# EAGLE design KissCart64-8K-MCU (EAGLE 6.6.0)
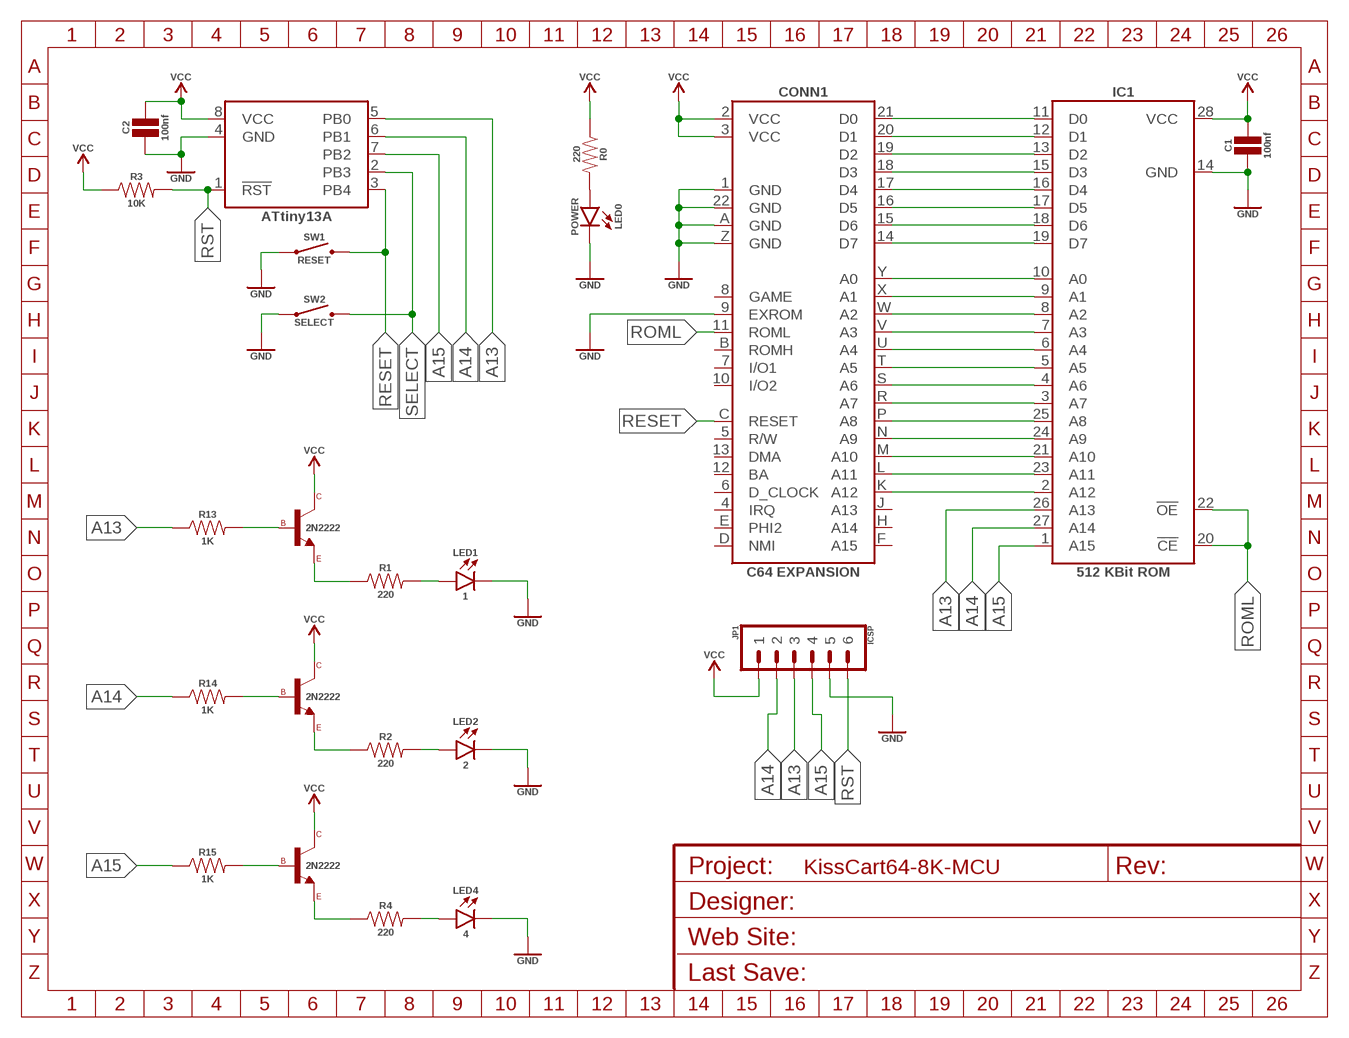
[diagram p0: schematic, sheet 1]
FRAME1 (FRAME_A5L): DESIGNER: Simon/CGTr; REVISION: 1.0; WEBSITE: http://www.commodore.gen.tr

## Parts
C1  100nf  CAPACITOR_CERAMIC_0.2  [CAPACITOR_CERAMIC_0.2]
C2  100nf  CAPACITOR_CERAMIC_1206  [CAPACITOR_CERAMIC_1206]
CONN1  C64 EXPANSION  C64_CARTDRIGE  [C64_CARTRIDGE]
IC1  512 KBit ROM  27C512_DIP  [DIP28W]
IC2  ATtiny13A  ATTINY13A-SU  [SOP08]
JP1  ICSP  HDR_2X03  [HDR_2X03]
LED0  POWER  LED_NORMAL_1206  [LED_1206]
LED1  1  LED_NORMAL_1206  [LED_1206]
LED2  2  LED_NORMAL_1206  [LED_1206]
LED4  4  LED_NORMAL_1206  [LED_1206]
Q1  2N2222  TRANSISTOR_NPN_MMBT2222A  [SOT-23]
Q2  2N2222  TRANSISTOR_NPN_MMBT2222A  [SOT-23]
Q3  2N2222  TRANSISTOR_NPN_MMBT2222A  [SOT-23]
R0  220  RESISTOR_SMT_1206  [RESISTOR_SMT_1206]
R1  220  RESISTOR_SMT_1206  [RESISTOR_SMT_1206]
R2  220  RESISTOR_SMT_1206  [RESISTOR_SMT_1206]
R3  10K  RESISTOR_SMT_1206  [RESISTOR_SMT_1206]
R4  220  RESISTOR_SMT_1206  [RESISTOR_SMT_1206]
R13  1K  RESISTOR_SMT_1206  [RESISTOR_SMT_1206]
R14  1K  RESISTOR_SMT_1206  [RESISTOR_SMT_1206]
R15  1K  RESISTOR_SMT_1206  [RESISTOR_SMT_1206]
SW1  RESET  SWITCH_THT_SIDE  [SWITCH_THT_SIDE]
SW2  SELECT  SWITCH_THT_SIDE  [SWITCH_THT_SIDE]

## Nets
A0: CONN1.Y(A0) IC1.10(A0)
A1: CONN1.X(A1) IC1.9(A1)
A2: CONN1.W(A2) IC1.8(A2)
A3: CONN1.V(A3) IC1.7(A3)
A4: CONN1.U(A4) IC1.6(A4)
A5: CONN1.T(A5) IC1.5(A5)
A6: CONN1.S(A6) IC1.4(A6)
A7: CONN1.R(A7) IC1.3(A7)
A8: CONN1.P(A8) IC1.25(A8)
A9: CONN1.N(A9) IC1.24(A9)
A10: CONN1.M(A10) IC1.21(A10)
A11: CONN1.L(A11) IC1.23(A11)
A12: CONN1.K(A12) IC1.2(A12)
A13: IC1.26(A13) IC2.5(PB0) JP1.3 R13.1
A13_1: Q1.1(BASE) R13.2
A14: IC1.27(A14) IC2.6(PB1) JP1.2 R14.1
A14_1: Q2.1(BASE) R14.2
A15: IC1.1(A15) IC2.7(PB2) JP1.4 R15.1
A15_1: Q3.1(BASE) R15.2
D0: CONN1.21(D0) IC1.11(D0)
D1: CONN1.20(D1) IC1.12(D1)
D2: CONN1.19(D2) IC1.13(D2)
D3: CONN1.18(D3) IC1.15(D3)
D4: CONN1.17(D4) IC1.16(D4)
D5: CONN1.16(D5) IC1.17(D5)
D6: CONN1.15(D6) IC1.18(D6)
D7: CONN1.14(D7) IC1.19(D7)
GND: C1.1 C2.1 CONN1.1(GND) CONN1.9(EXROM) CONN1.22(GND) CONN1.A(GND) CONN1.Z(GND) IC1.14(GND) IC2.4(GND) JP1.5 LED0.C LED1.C LED2.C LED4.C SW1.1 SW2.1
LED0_1: LED0.A R0.2
LED1_1: Q1.2(EMITTER) R1.1
LED1_2: LED1.A R1.2
LED2_1: Q2.2(EMITTER) R2.1
LED2_2: LED2.A R2.2
LED4_1: Q3.2(EMITTER) R4.1
LED4_2: LED4.A R4.2
RESET: CONN1.C(RESET) IC2.3(PB4) SW1.2
ROML: CONN1.11(ROML) IC1.20(!CE) IC1.22(!OE)
RST: IC2.1(!RST) JP1.6 R3.2
SELECT: IC2.2(PB3) SW2.2
VCC: C1.2 C2.2 CONN1.2(VCC) CONN1.3(VCC) IC1.28(VCC) IC2.8(VCC) JP1.1 Q1.3(COLLECTOR) Q2.3(COLLECTOR) Q3.3(COLLECTOR) R0.1 R3.1
Unconnected: CONN1.4(IRQ) CONN1.5(R/W) CONN1.6(D_CLOCK) CONN1.7(I/O1) CONN1.8(GAME) CONN1.10(I/O2) CONN1.12(BA) CONN1.13(DMA) CONN1.B(ROMH) CONN1.D(NMI) CONN1.E(PHI2) CONN1.F(A15) CONN1.H(A14) CONN1.J(A13)

## Library data of the parts
C1 C2 = sj_standart:CAPACITOR_CERAMIC: Ceramic Capacitor
CONN1 = sj_commodore:C64_CARTDRIGE: C64 Cartridge Pads
IC1 = sj_ic:27C512: CMOS EPROM 512 K (64 K x 8)
IC2 = sj_mcu:ATTINY13: ATTINY13 MCU - 1 KB FLASH, 64 bytes SRAM, 64 bytes EEPROM
JP1 = sj_connectors:HDR_2X03: 2x03 - 0.1" Pin Header
LED0 LED1 LED2 LED4 = sj_standart:LED_NORMAL: Standard LED
Q1-Q3 = sj_standart:TRANSISTOR_NPN: Generic NPN Bipolar Junction Transistor
R0 R1-R4 R13-R15 = sj_standart:RESISTOR: Resistor
SW1 SW2 = sj_standart:SWITCH: Switch

## Board
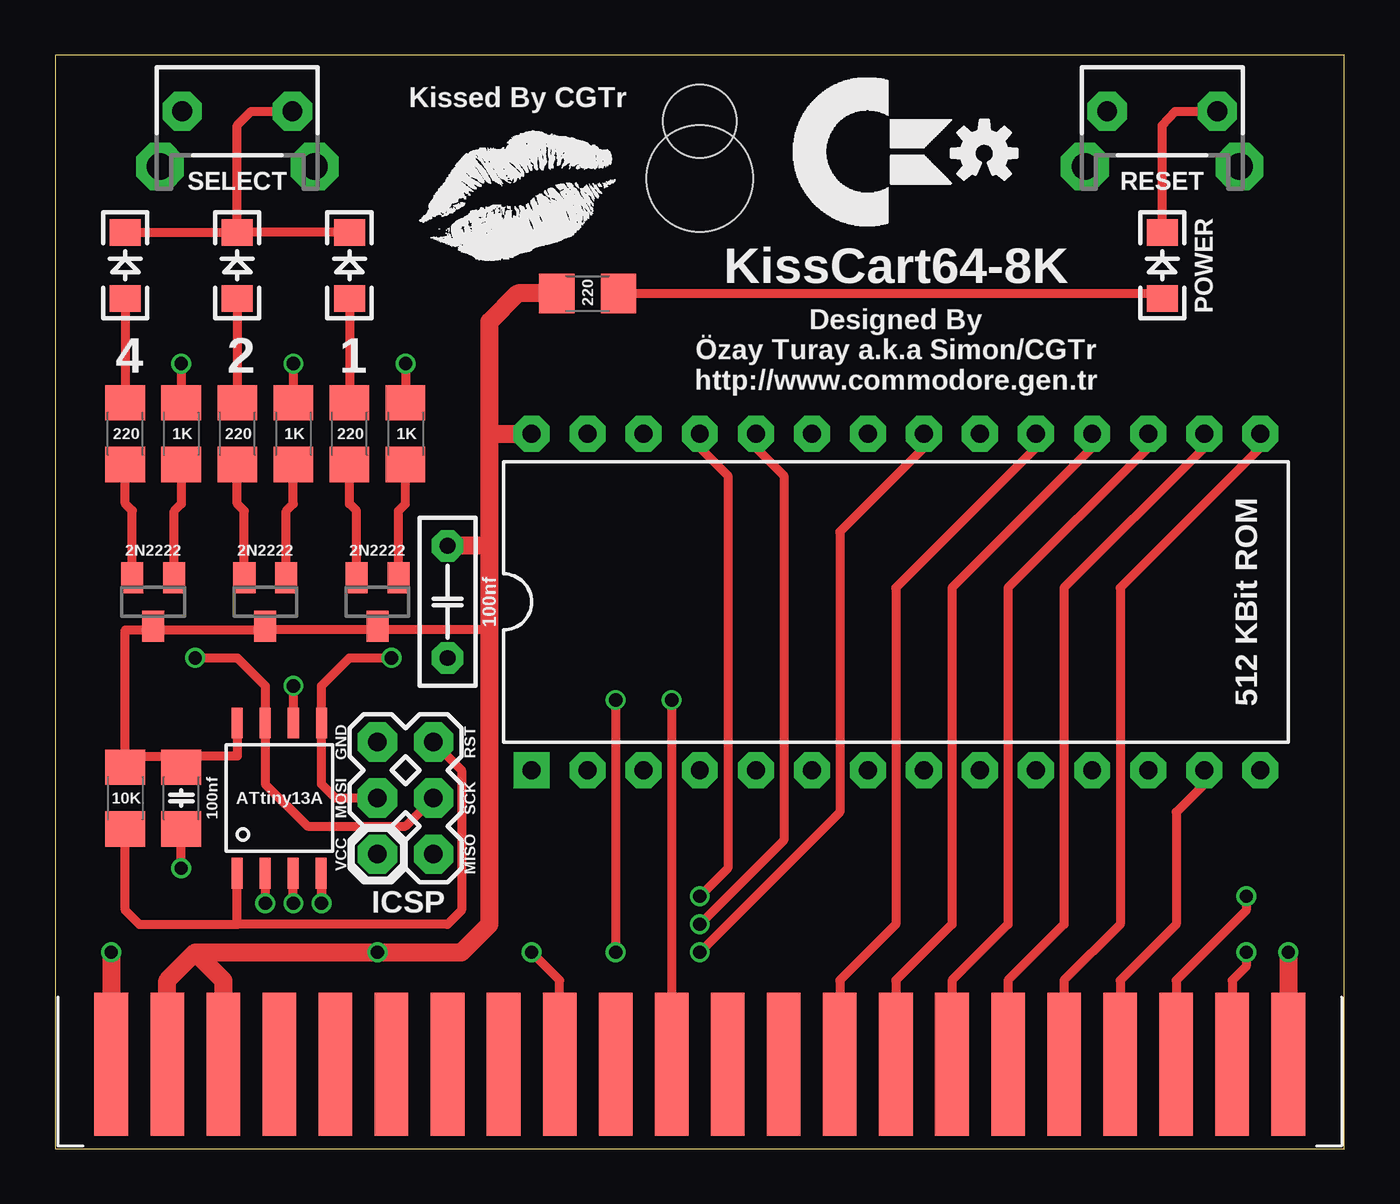
[diagram p1: board, top side]
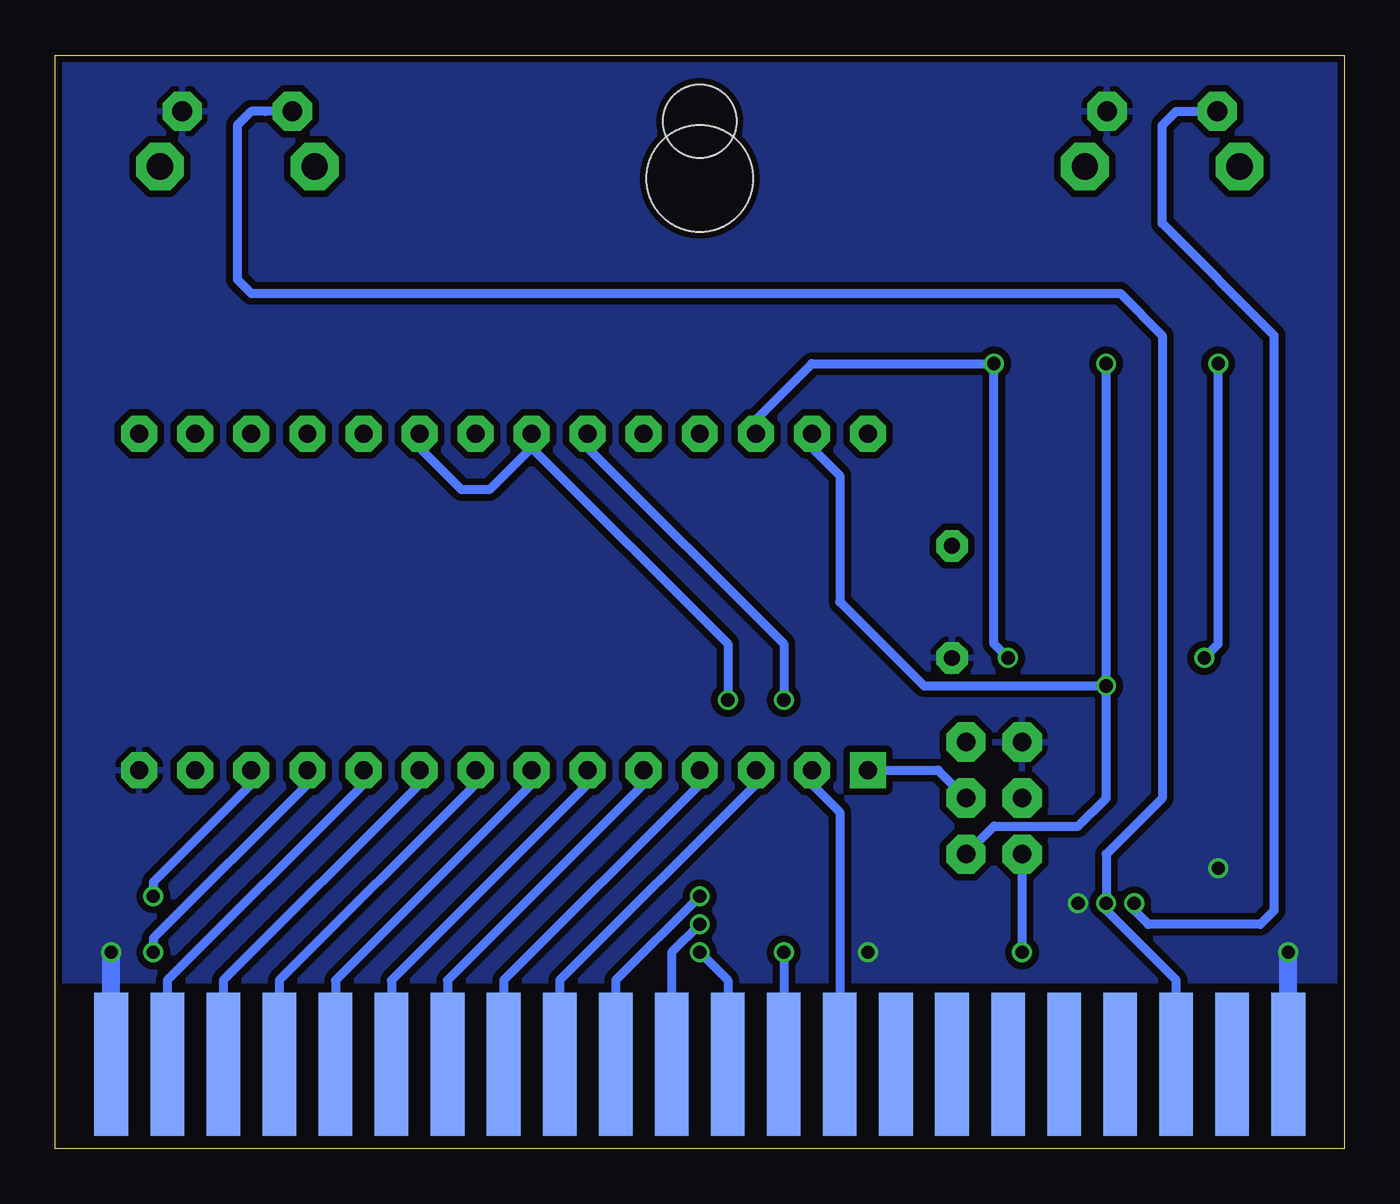
[diagram p2: board, bottom side, seen from below]

Size 58.42 x 49.53 mm. Coordinates in mm from the lower left corner, seen from the top.
Outline: 0,0 58.42,0 58.42,49.53 0,49.53 0,0
Copper layers (1*16): Top 0.035mm / dielectric 1.5mm / Bottom 0.035mm
Design rules "DirtyPCBs": minimum track width 5mil, minimum drill 12mil, track to track 5mil, track to pad 5mil, pad to pad 5mil, via to via 5mil, smd to smd 0mil, copper to edge 10mil, drill to drill 10mil, minimum pad ring 10mil, minimum via ring 6mil, stop-mask expansion 2mil, vias tented up to drill 25mil, thermal gap 10mil
Holes 4.8 mm at 29.21,43.94
Holes 3.3 mm at 29.21,46.54

### Footprints (pad centres in the part's own frame; a part is rotated, then mirrored left to right if it is on the bottom)
CAPACITOR_CERAMIC_0.2 = drill 0.711 pad 1.422 octagon: 1 -2.54,0; 2 2.54,0
CAPACITOR_CERAMIC_1206 = smd 1.6 x 1.8: 1 -1.4,0; 2 1.4,0
C64_CARTRIDGE = smd 1.524 x 6.477: 1 -26.67,-0.635; 2 -24.13,-0.635; 3 -21.59,-0.635; 4 -19.05,-0.635; 5 -16.51,-0.635; 6 -13.97,-0.635; 7 -11.43,-0.635; 8 -8.89,-0.635; 9 -6.35,-0.635; 10 -3.81,-0.635; 11 -1.27,-0.635; 12 1.27,-0.635; 13 3.81,-0.635; 14 6.35,-0.635; 15 8.89,-0.635; 16 11.43,-0.635; 17 13.97,-0.635; 18 16.51,-0.635; 19 19.05,-0.635; 20 21.59,-0.635; 21 24.13,-0.635; 22 26.67,-0.635 | smd 1.524 x 6.477 bottom: A -26.67,-0.635; B -24.13,-0.635; C -21.59,-0.635; D -19.05,-0.635; E -16.51,-0.635; F -13.97,-0.635; H -11.43,-0.635; J -8.89,-0.635; K -6.35,-0.635; L -3.81,-0.635; M -1.27,-0.635; N 1.27,-0.635; P 3.81,-0.635; R 6.35,-0.635; S 8.89,-0.635; T 11.43,-0.635; U 13.97,-0.635; V 16.51,-0.635; W 19.05,-0.635; X 21.59,-0.635; Y 24.13,-0.635; Z 26.67,-0.635
DIP28W = drill 0.813 pad 1.626 square: 1 -16.51,-7.62 | drill 0.813 pad 1.626 octagon: 2 -13.97,-7.62; 3 -11.43,-7.62; 4 -8.89,-7.62; 5 -6.35,-7.62; 6 -3.81,-7.62; 7 -1.27,-7.62; 8 1.27,-7.62; 9 3.81,-7.62; 10 6.35,-7.62; 11 8.89,-7.62; 12 11.43,-7.62; 13 13.97,-7.62; 14 16.51,-7.62; 15 16.51,7.62; 16 13.97,7.62; 17 11.43,7.62; 18 8.89,7.62; 19 6.35,7.62; 20 3.81,7.62; 21 1.27,7.62; 22 -1.27,7.62; 23 -3.81,7.62; 24 -6.35,7.62; 25 -8.89,7.62; 26 -11.43,7.62; 27 -13.97,7.62; 28 -16.51,7.62
SOP08 = smd 0.5 x 1.4: 1 -1.905,-3.404; 2 -0.645,-3.404; 3 0.625,-3.404; 4 1.895,-3.404; 5 1.905,3.404; 6 0.635,3.404; 7 -0.635,3.404; 8 -1.905,3.404
HDR_2X03 = drill 0.838 pad 1.778 octagon: 1 0,0; 2 0,-2.54; 3 2.54,0; 4 2.54,-2.54; 5 5.08,0; 6 5.08,-2.54
LED_1206 = smd 1.2 x 1.4: A -1.5,0; C 1.5,0
SOT-23 = smd 1 x 1.4: 1 -0.95,-1.1; 2 0.95,-1.1; 3 0,1.1
RESISTOR_SMT_1206 = smd 1.6 x 1.8: 1 -1.4,0; 2 1.4,0
SWITCH_THT_SIDE = drill 0.889 pad 1.778 octagon: 1 -2.5,0; 2 2.5,0 | drill 1.194 pad 2.159 octagon: ANCHOR1 -3.5,2.5; ANCHOR2 3.5,2.5

### Placement (x,y rotation side)
C1  17.78,24.77 90 top
C2  5.71,15.88 90 top
CONN1  29.21,4.45 0 top
IC1  38.1,24.77 0 top
IC2  10.16,15.88 0 top
JP1  14.61,13.34 90 top
LED0  50.16,40.01 90 top
LED1  13.34,40.01 90 top
LED2  8.26,40.01 90 top
LED4  3.17,40.01 90 top
LOGO1  OSHW_LOGO_SMALL  [OSHW_LOGO_SMALL]  42.1,45.09 0 top
Q1  14.61,24.77 180 top
Q2  9.53,24.77 180 top
Q3  4.45,24.77 180 top
R0  24.13,38.73 0 top
R1  13.34,32.38 90 top
R2  8.26,32.38 90 top
R3  3.17,15.88 270 top
R4  3.17,32.38 90 top
R13  15.88,32.38 270 top
R14  10.79,32.38 270 top
R15  5.71,32.38 270 top
SW1  50.16,46.99 180 top
SW2  8.26,46.99 180 top

### Tracks (layer width: path | path; a pad name or v marks a point on that pad's centre or on a via)
A0
  Bottom 0.406: IC1.10 44.45,16.51 53.34,7.62 CONN1.Y
A1
  Bottom 0.406: IC1.9 41.91,16.51 50.8,7.62 50.8,6.99 CONN1.X
A2
  Bottom 0.406: IC1.8 39.37,16.51 48.26,7.62 48.26,6.99 CONN1.W
A3
  Bottom 0.406: IC1.7 36.83,16.51 45.09,8.26 45.72,7.62 45.72,6.99 CONN1.V
A4
  Bottom 0.406: IC1.6 34.29,16.51 43.18,7.62 43.18,6.99 CONN1.U
A5
  Bottom 0.406: IC1.5 31.75,16.51 40.64,7.62 40.64,6.99 CONN1.T
A6
  Bottom 0.406: IC1.4 29.21,16.51 38.1,7.62 38.1,6.99 CONN1.S
A7
  Bottom 0.406: IC1.3 26.67,16.51 35.56,7.62 CONN1.R
A8  (via drill 0.6)
  Top 0.406: IC1.25 29.21,31.75 30.48,30.48 30.48,12.7 v29.21,11.43
  Bottom 0.406: v29.21,11.43 33.02,7.62 CONN1.P
A9  (via drill 0.6)
  Top 0.406: IC1.24 31.75,31.75 33.02,30.48 33.02,13.97 v29.21,10.16
  Bottom 0.406: v29.21,10.16 30.48,8.89 CONN1.N
A10  (via drill 0.6)
  Top 0.406: IC1.21 39.37,31.75 35.56,27.94 35.56,15.24 v29.21,8.89
  Bottom 0.406: v29.21,8.89 27.94,7.62 CONN1.M
A11  (via drill 0.6)
  Top 0.406: v25.4,20.32 v25.4,8.89
  Bottom 0.406: IC1.23 34.29,31.75 25.4,22.86 v25.4,20.32 | v25.4,8.89 CONN1.L
A12
  Bottom 0.406: IC1.2 24.13,16.51 22.86,15.24 CONN1.K
A13  (via drill 0.6)
  Top 0.406: v15.88,35.56 R13.1 | JP1.3 12.7,15.88 12.06,16.51 IC2.5 12.06,20.95 13.34,22.23 v15.24,22.23
  Bottom 0.406: IC1.26 26.67,33.02 24.13,35.56 v15.88,35.56 15.88,22.86 v15.24,22.23
A13_1
  Top 0.406: Q1.1 15.55,28.89 15.88,29.21 R13.2
A14  (via drill 0.6)
  Top 0.406: v10.79,35.56 R14.1 | v10.79,20.95 IC2.6
  Bottom 0.406: IC1.27 24.13,31.75 22.86,30.48 22.86,24.77 19.05,20.95 v10.79,20.95 | JP1.2 15.88,14.61 12.06,14.61 10.79,15.88 v10.79,20.95 | v10.79,20.95 v10.79,35.56
A14_1
  Top 0.406: Q2.1 10.47,28.89 10.79,29.21 R14.2
A15  (via drill 0.6)
  Top 0.406: v5.71,35.56 R15.1 | v6.35,22.23 8.26,22.23 9.53,20.95 IC2.7 9.53,16.51 11.43,14.61 15.88,14.61 JP1.4
  Bottom 0.406: IC1.1 18.41,17.14 JP1.4 | v6.35,22.23 5.71,22.86 v5.71,35.56
A15_1
  Top 0.406: R15.2 5.71,29.21 5.39,28.89 Q3.1
D0  (via drill 0.6)
  Top 0.406: v53.98,8.89 53.98,8.26 53.34,7.62 CONN1.21
  Bottom 0.406: IC1.11 46.99,16.51 53.98,9.53 v53.98,8.89
D1  (via drill 0.6)
  Top 0.406: v53.98,11.43 53.98,10.79 50.8,7.62 CONN1.20
  Bottom 0.406: IC1.12 49.53,16.51 53.98,12.06 v53.98,11.43
D2
  Top 0.406: IC1.13 52.07,16.51 50.8,15.24 50.8,10.16 48.26,7.62 CONN1.19
D3
  Top 0.406: IC1.15 54.61,31.75 48.26,25.4 48.26,10.16 45.72,7.62 CONN1.18
D4
  Top 0.406: IC1.16 52.07,31.75 45.72,25.4 45.72,10.16 43.18,7.62 CONN1.17
D5
  Top 0.406: IC1.17 49.53,31.75 43.18,25.4 43.18,10.16 40.64,7.62 CONN1.16
D6
  Top 0.406: IC1.18 46.99,31.75 40.64,25.4 40.64,10.16 38.1,7.62 CONN1.15
D7
  Top 0.406: IC1.19 44.45,31.75 38.1,25.4 38.1,10.16 35.56,7.62 CONN1.14
GND  (via drill 0.6)
  Top 0.406: CONN1.9 22.86,7.62 v21.59,8.89 | LED0.C 50.16,46.35 50.76,46.99 SW1.1 | LED4.C LED2.C | LED2.C 8.26,46.35 8.89,46.99 SW2.1 | LED1.C LED2.C | v5.71,12.7 C2.1 | v12.06,11.11 12.06,11.19 IC2.4 12.06,12.47 12.06,11.43
  Top 0.813: v2.54,8.89 CONN1.A | v55.88,8.89 CONN1.Z
  Bottom 0.813: CONN1.A v2.54,8.89 | CONN1.Z v55.88,8.89
  pour Bottom (isolate 0.305): 0,7.62 58.42,7.62 58.42,49.53 0,49.53
LED0_1
  Top 0.406: R0.2 50.16,38.73 LED0.A
LED1_1
  Top 0.406: Q1.2 13.65,28.89 13.34,29.21 R1.1
LED1_2
  Top 0.406: LED1.A R1.2
LED2_1
  Top 0.406: Q2.2 8.57,28.89 8.26,29.21 R2.1
LED2_2
  Top 0.406: LED2.A R2.2
LED4_1
  Top 0.406: Q3.2 3.5,28.89 3.17,29.21 R4.1
LED4_2
  Top 0.406: LED4.A R4.2
RESET  (via drill 0.6)
  Top 0.406: v10.79,11.11 10.79,11.83 IC2.3
  Bottom 0.406: CONN1.C 7.62,7.62 10.79,10.79 v10.79,11.11 10.79,13.34 8.26,15.88 8.26,36.83 10.16,38.73 49.53,38.73 50.16,39.37 50.16,46.35 49.53,46.99 SW1.2 48.9,46.99
ROML  (via drill 0.6)
  Top 0.406: v27.94,20.32 CONN1.11
  Bottom 0.406: 36.83,31.75 38.73,29.84 40.01,29.84 41.91,31.75 IC1.20 | 36.83,31.75 27.94,22.86 v27.94,20.32 | IC1.22 36.83,31.75
RST
  Top 0.406: 8.26,10.16 3.81,10.16 3.17,10.79 R3.2 | JP1.6 18.41,17.14 18.41,10.79 17.78,10.16 8.26,10.16 | 8.26,10.16 IC2.1
SELECT  (via drill 0.6)
  Top 0.406: IC2.2 9.53,12.06 v9.53,11.11
  Bottom 0.406: 5.71,46.99 SW2.2 7.62,46.99 8.26,46.35 8.26,41.91 3.17,36.83 3.17,10.79 3.81,10.16 8.89,10.16 9.53,10.79 v9.53,11.11
VCC  (via drill 0.6)
  Top 0.406: C1.2 | R3.1 3.17,17.78 | 3.17,17.78 5.71,17.78 | 5.71,17.78 C2.2 | 19.68,23.5 14.61,23.5 | Q1.3 14.61,23.5 | 14.61,23.5 9.53,23.5 | 4.45,23.5 9.53,23.5 | 9.53,23.5 Q2.3 | IC2.8 8.26,17.78 5.71,17.78 | 3.17,17.78 3.17,23.5 4.45,23.5 | 4.45,23.5 Q3.3
  Top 0.813: CONN1.3 7.62,7.62 6.35,8.89 | CONN1.2 5.08,7.62 6.35,8.89 | 19.68,27.3 19.68,23.5 19.68,10.16 18.41,8.89 v14.61,8.89 6.35,8.89 | 19.68,27.3 C1.2 | 19.68,27.3 19.68,32.38 | 19.68,32.38 IC1.28 | R0.1 20.95,38.73 19.68,37.47 19.68,32.38
  Bottom 0.406: JP1.1 v14.61,8.89

### Text on the board
tPlace: Kissed By CGTr | KissCart64-8K | Designed By / Özay Turay a.k.a Simon/CGTr / http://www.commodore.gen.tr | GND | RST | MOSI | SCK | VCC | MISO